# EAGLE design main-pic-bord (EAGLE 8.0.1)
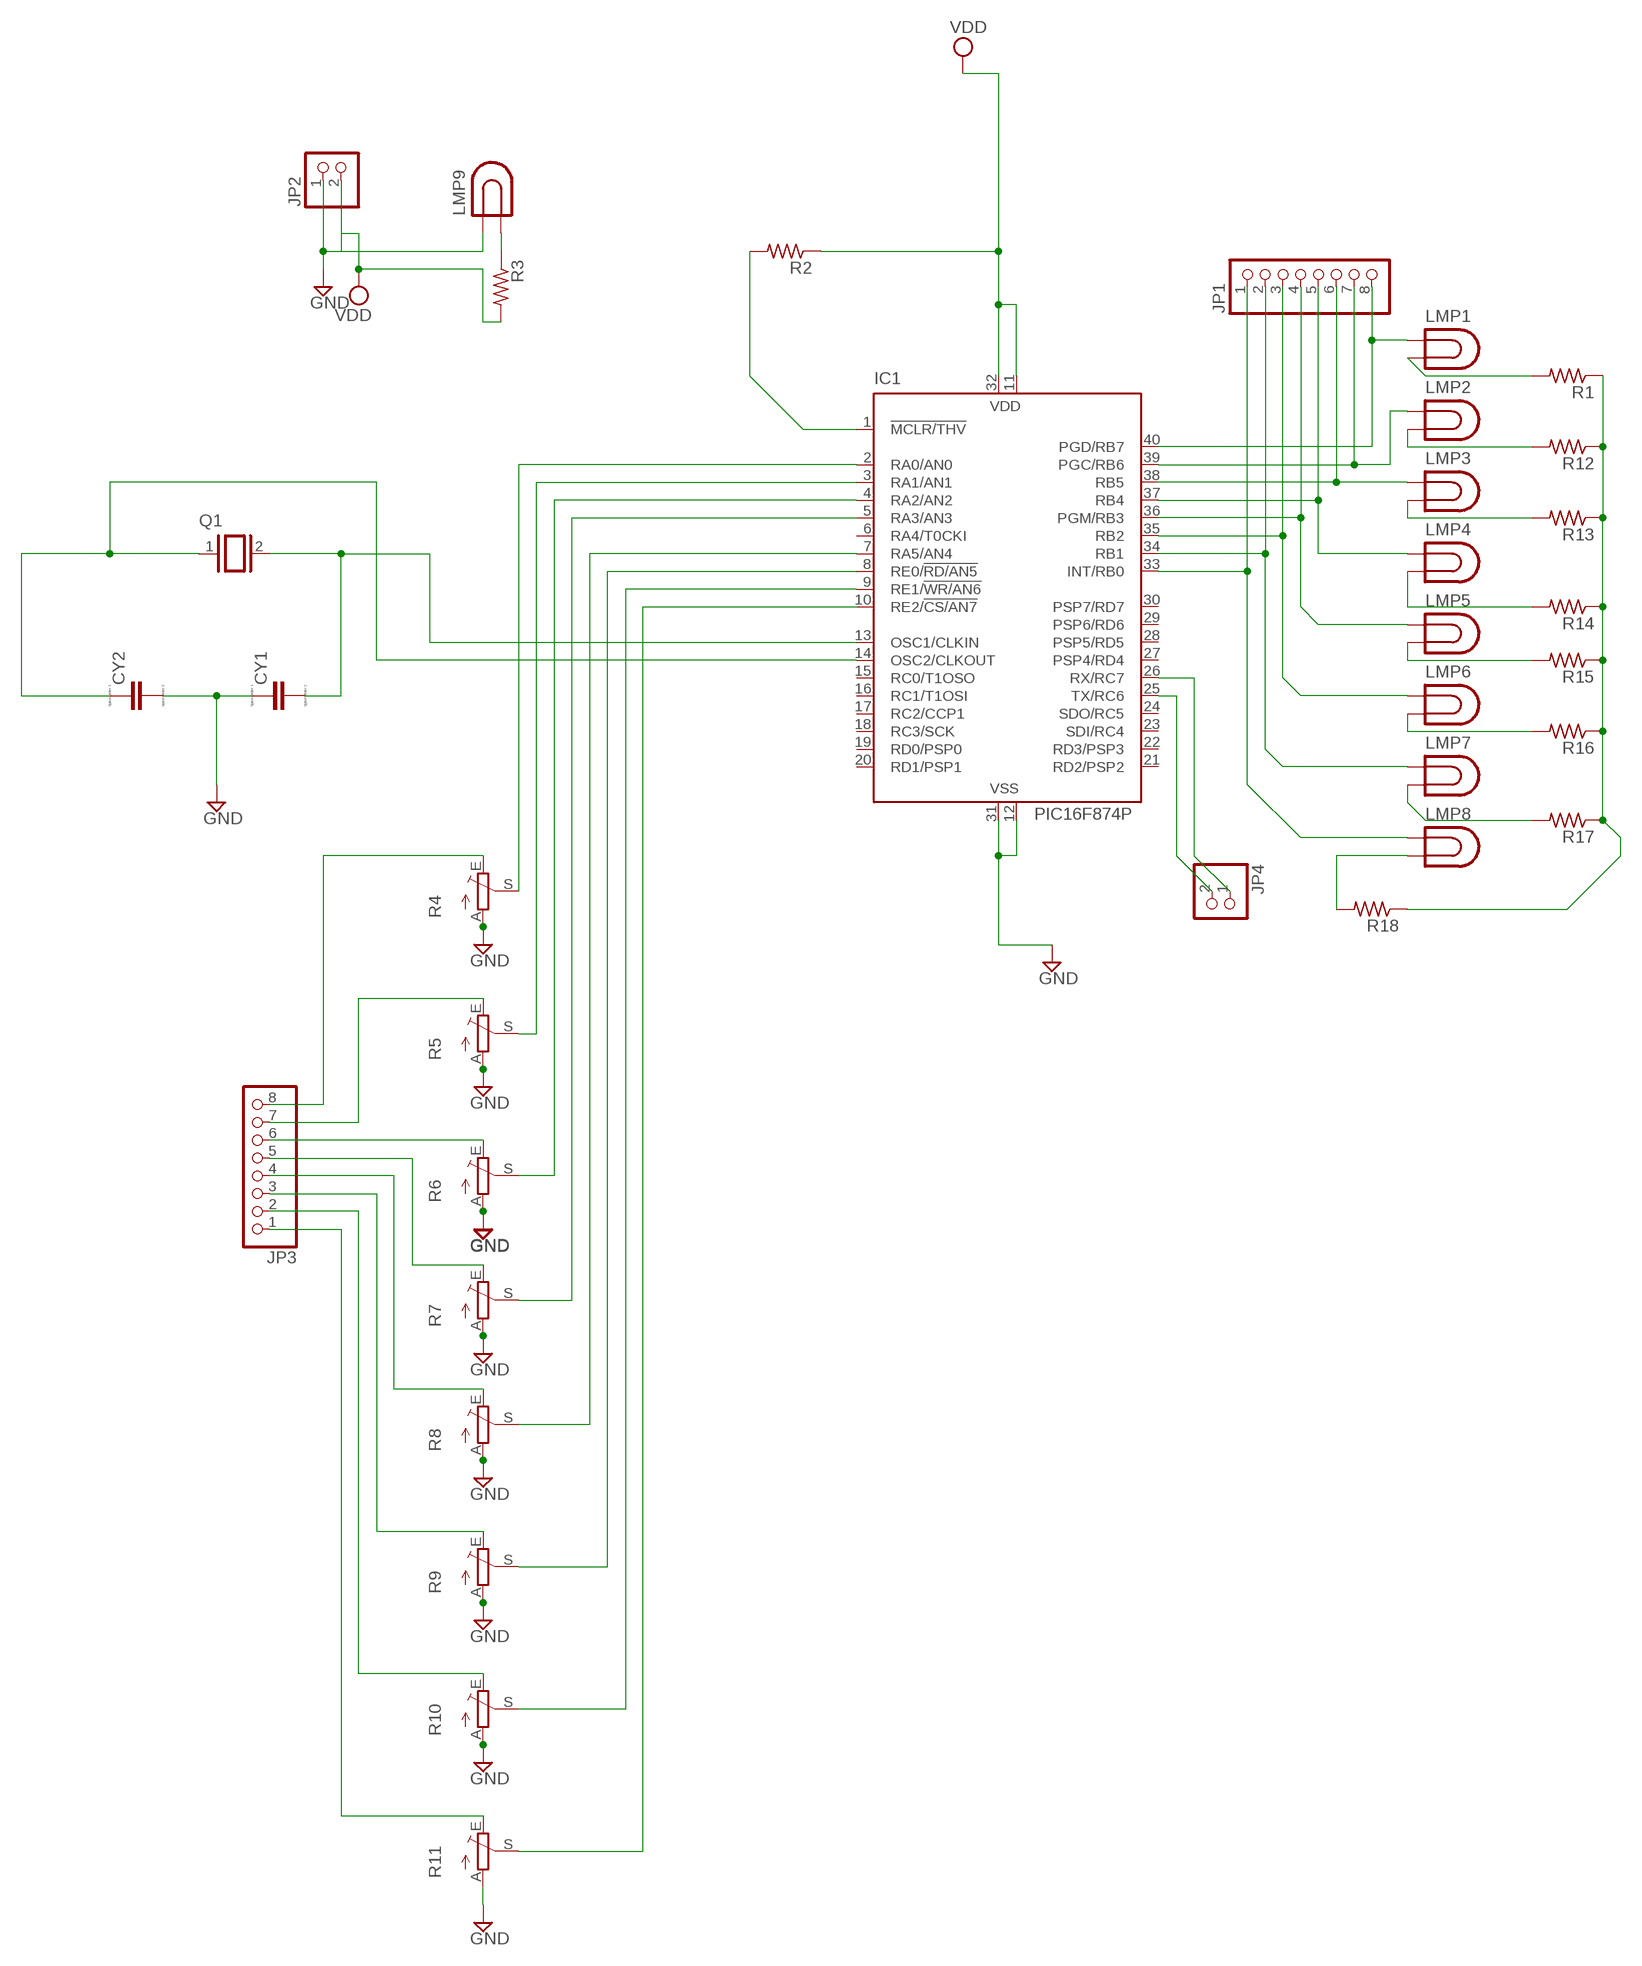
[diagram p0: schematic, sheet 1]

## Parts
CY1  CYYC7B5  [YC7B5]
CY2  CYYC7B5  [YC7B5]
IC1  PIC16F874P  [DIL40]
JP1  PINHD-1X8  [1X08]
JP2  PINHD-1X2  [1X02]
JP3  PINHD-1X8  [1X08]
JP4  PINHD-1X2  [1X02]
LMP1  LAMP  [LDH-5R]
LMP2  LAMP  [LDH-5R]
LMP3  LAMP  [LDH-5R]
LMP4  LAMP  [LDH-5R]
LMP5  LAMP  [LDH-5R]
LMP6  LAMP  [LDH-5R]
LMP7  LAMP  [LDH-5R]
LMP8  LAMP  [LDH-5R]
LMP9  LAMP  [LDH-5R]
Q1  XTAL/S  [QS]
R1  R-US_VMTB60  [VMTB60]
R2  R-US_VMTB60  [VMTB60]
R3  R-US_VMTB60  [VMTB60]
R4  TRIM_EU-CA6V  [CA6V]
R5  TRIM_EU-CA6V  [CA6V]
R6  TRIM_EU-CA6V  [CA6V]
R7  TRIM_EU-CA6V  [CA6V]
R8  TRIM_EU-CA6V  [CA6V]
R9  TRIM_EU-CA6V  [CA6V]
R10  TRIM_EU-CA6V  [CA6V]
R11  TRIM_EU-CA6V  [CA6V]
R12  R-US_VMTB60  [VMTB60]
R13  R-US_VMTB60  [VMTB60]
R14  R-US_VMTB60  [VMTB60]
R15  R-US_VMTB60  [VMTB60]
R16  R-US_VMTB60  [VMTB60]
R17  R-US_VMTB60  [VMTB60]
R18  R-US_VMTB60  [VMTB60]

## Nets
GND: CY1.1 CY2.2 IC1.12(VSS) IC1.31(VSS) JP2.1 LMP9.1 R4.A R5.A R6.A R7.A R8.A R9.A R10.A R11.A
N$1: IC1.2(RA0/AN0) R4.S
N$2: IC1.3(RA1/AN1) R5.S
N$3: IC1.4(RA2/AN2) R6.S
N$4: IC1.5(RA3/AN3) R7.S
N$5: IC1.7(RA5/AN4) R8.S
N$6: IC1.8(RE0/!RD/AN5) R9.S
N$7: IC1.9(RE1/!WR/AN6) R10.S
N$8: IC1.10(RE2/!CS/AN7) R11.S
N$9: JP3.8 R4.E
N$10: JP3.7 R5.E
N$11: JP3.6 R6.E
N$12: JP3.5 R7.E
N$13: JP3.4 R8.E
N$14: JP3.3 R9.E
N$15: JP3.2 R10.E
N$16: JP3.1 R11.E
N$17: IC1.33(INT/RB0) JP1.1 LMP8.1
N$18: CY1.2 IC1.13(OSC1/CLKIN) Q1.2
N$19: CY2.1 IC1.14(OSC2/CLKOUT) Q1.1
N$20: IC1.34(RB1) JP1.2 LMP7.1
N$21: IC1.35(RB2) JP1.3 LMP6.1
N$22: IC1.36(PGM/RB3) JP1.4 LMP5.1
N$23: IC1.37(RB4) JP1.5 LMP4.1
N$24: IC1.38(RB5) JP1.6 LMP3.1
N$25: IC1.39(PGC/RB6) JP1.7 LMP2.1
N$26: IC1.40(PGD/RB7) JP1.8 LMP1.1
N$27: LMP9.2 R3.1
N$28: LMP8.2 R18.2
N$29: IC1.25(TX/RC6) JP4.2
N$30: IC1.26(RX/RC7) JP4.1
N$31: LMP7.2 R17.2
N$32: LMP6.2 R16.2
N$33: LMP2.2 R12.2
N$34: IC1.1(!MCLR/THV) R2.2
N$35: LMP5.2 R15.2
N$36: LMP4.2 R14.2
N$37: LMP3.2 R13.2
N$38: LMP1.2 R1.2
N$40: R1.1 R12.1 R13.1 R14.1 R15.1 R16.1 R17.1 R18.1
VDD: IC1.11(VDD) IC1.32(VDD) JP2.2 R2.1 R3.2
Unconnected: IC1.6(RA4/T0CKI) IC1.15(RC0/T1OSO) IC1.16(RC1/T1OSI) IC1.17(RC2/CCP1) IC1.18(RC3/SCK) IC1.19(RD0/PSP0) IC1.20(RD1/PSP1) IC1.21(RD2/PSP2) IC1.22(RD3/PSP3) IC1.23(SDI/RC4) IC1.24(SDO/RC5) IC1.27(PSP4/RD4) IC1.28(PSP5/RD5) IC1.29(PSP6/RD6) IC1.30(PSP7/RD7)

## Library data of the parts
CY1 CY2 = resistor:CY: Y CAPACITOR for power line
IC1 = microchip:PIC16F87*: MICROCONTROLLER; MPN: PIC16F874-04I/P; OC_FARNELL: 1196797; OC_NEWARK: 24M5903
JP1 JP3 = pinhead:PINHD-1X8: PIN HEADER
JP2 JP4 = pinhead:PINHD-1X2: PIN HEADER
LMP1-LMP9 = special:LAMP: LED HOLDER
Q1 = special:XTAL/S: CRYSTAL
R1-R3 R12-R18 = resistor:R-US_: RESISTOR, American symbol
R4-R11 = pot:TRIM_EU-: POTENTIOMETER

## Board
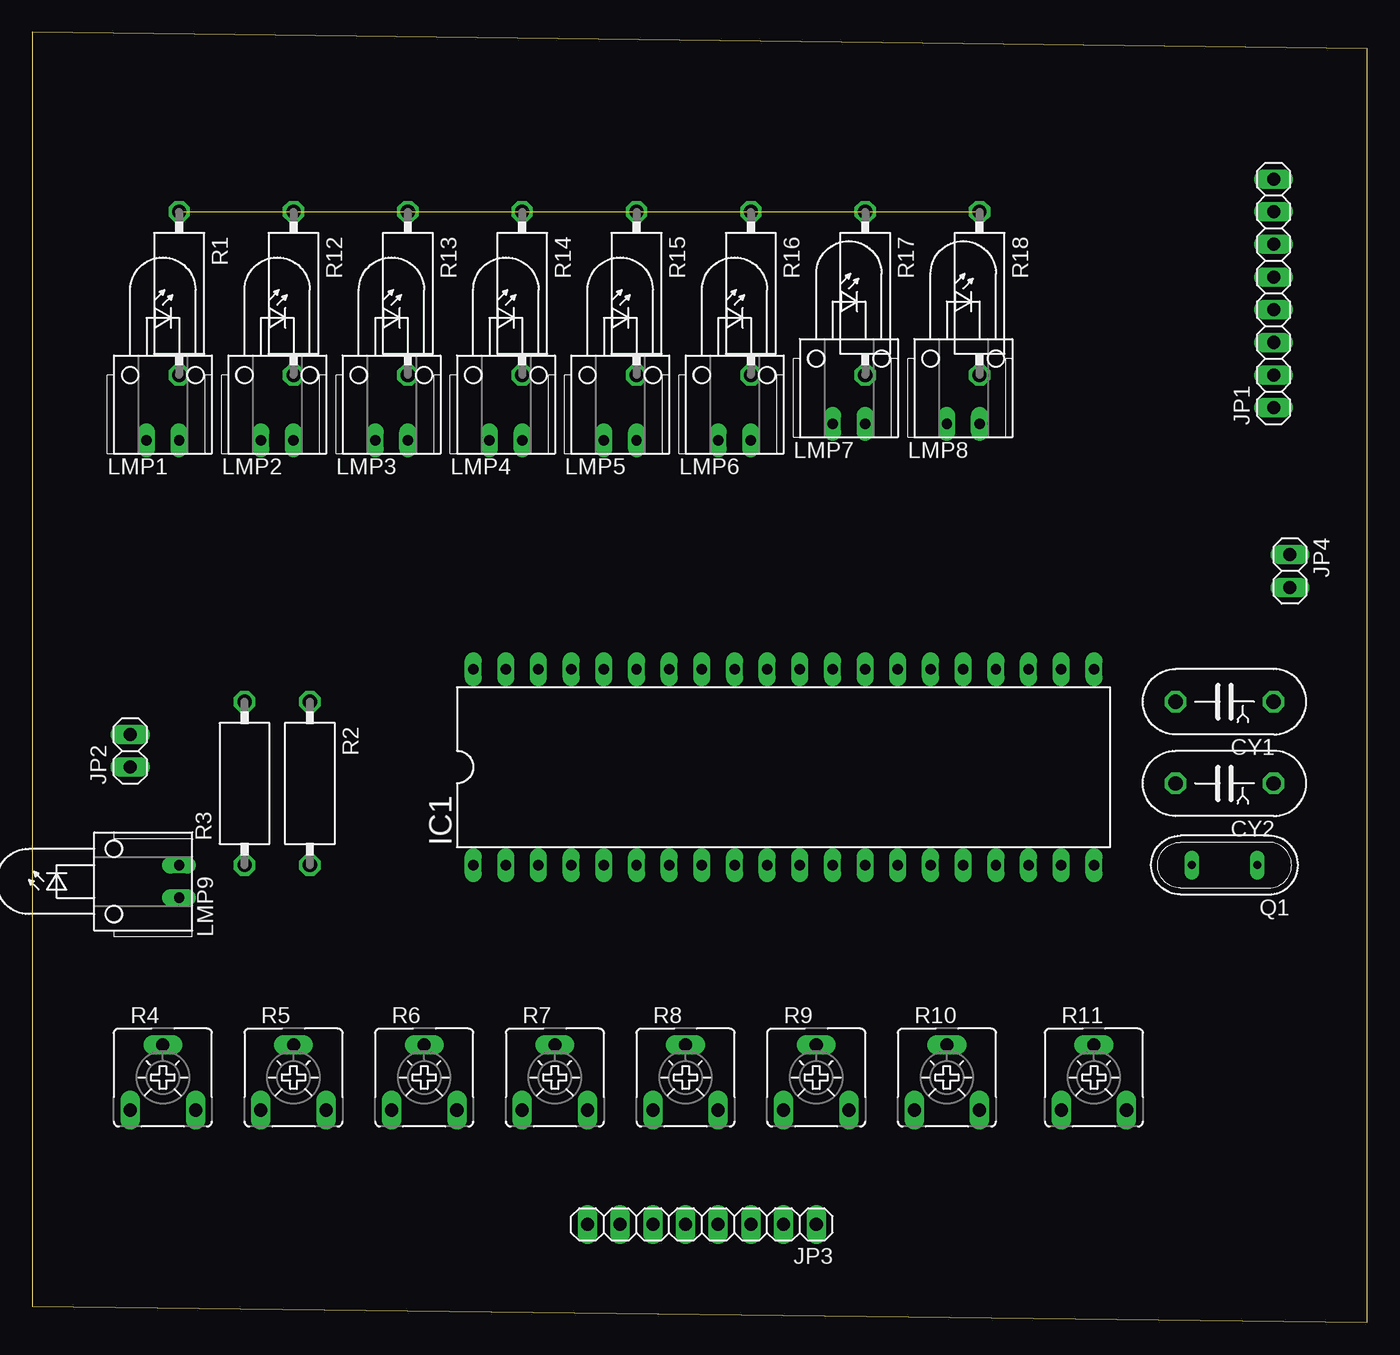
[diagram p1: board, top side]
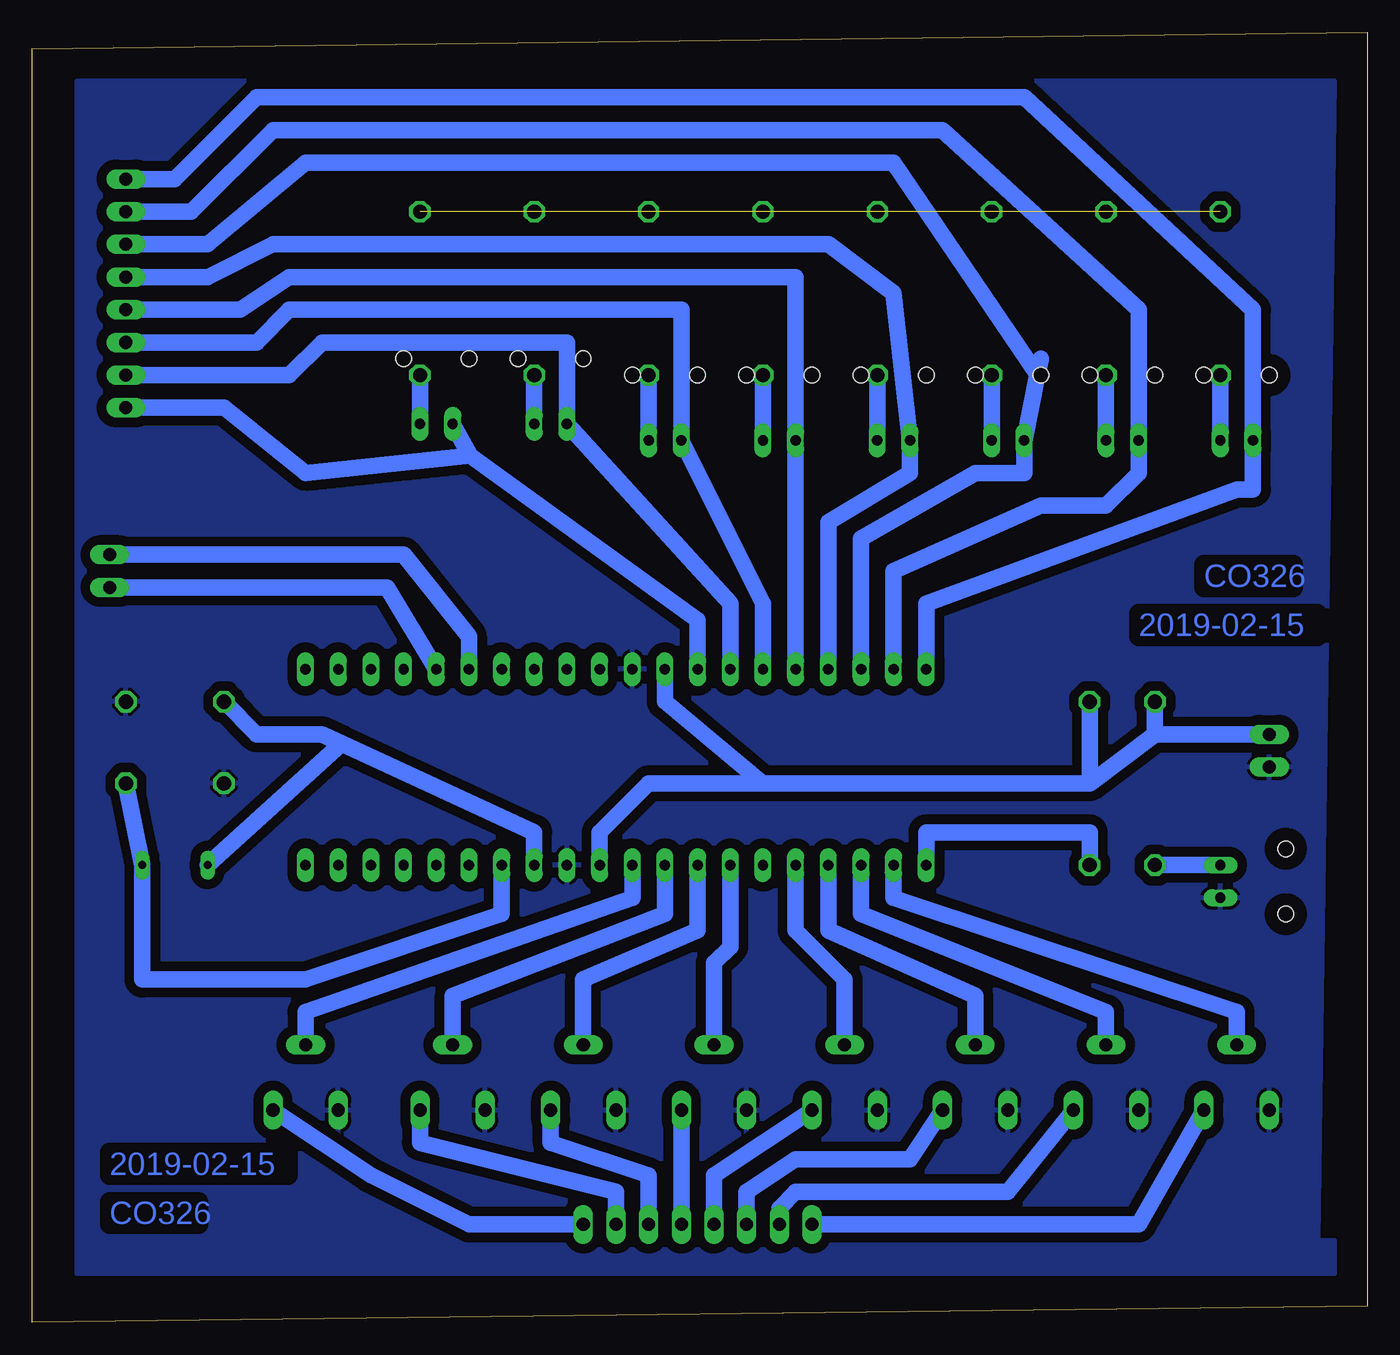
[diagram p2: board, bottom side, seen from below]

Size 103.81 x 100.32 mm. Coordinates in mm from the lower left corner, seen from the top.
Outline: 0,1.27 103.81,0 103.81,99.05 0,100.32 0,1.27
Copper layers (1*16): Top 0.035mm / dielectric 1.5mm / Bottom 0.035mm
Design rules "default *": minimum track width 10mil, minimum drill 24mil, track to track 30mil, track to pad 30mil, pad to pad 30mil, via to via 30mil, smd to smd 30mil, copper to edge 40mil, drill to drill 8mil, minimum pad ring 10mil, minimum via ring 8mil, stop-mask expansion 4mil, vias tented up to drill 0mil, thermal gap 10mil

### Footprints (pad centres in the part's own frame; a part is rotated, then mirrored left to right if it is on the bottom)
YC7B5 = drill 1.118 octagon: 1 -3.81,0; 2 3.81,0
DIL40 = drill 0.813 long: 1 -24.13,-7.62; 2 -21.59,-7.62; 3 -19.05,-7.62; 4 -16.51,-7.62; 5 -13.97,-7.62; 6 -11.43,-7.62; 7 -8.89,-7.62; 8 -6.35,-7.62; 9 -3.81,-7.62; 10 -1.27,-7.62; 11 1.27,-7.62; 12 3.81,-7.62; 13 6.35,-7.62; 14 8.89,-7.62; 15 11.43,-7.62; 16 13.97,-7.62; 17 16.51,-7.62; 18 19.05,-7.62; 19 21.59,-7.62; 20 24.13,-7.62; 21 24.13,7.62; 22 21.59,7.62; 23 19.05,7.62; 24 16.51,7.62; 25 13.97,7.62; 26 11.43,7.62; 27 8.89,7.62; 28 6.35,7.62; 29 3.81,7.62; 30 1.27,7.62; 31 -1.27,7.62; 32 -3.81,7.62; 33 -6.35,7.62; 34 -8.89,7.62; 35 -11.43,7.62; 36 -13.97,7.62; 37 -16.51,7.62; 38 -19.05,7.62; 39 -21.59,7.62; 40 -24.13,7.62
1X08 = drill 1.016 long: 1 -8.89,0; 2 -6.35,0; 3 -3.81,0; 4 -1.27,0; 5 1.27,0; 6 3.81,0; 7 6.35,0; 8 8.89,0
1X02 = drill 1.016 long: 1 -1.27,0; 2 1.27,0
LDH-5R = drill 0.813 long: 1 -1.27,-5.08; 2 1.27,-5.08 | hole 1.219: 2.54,0; -2.54,0
QS = drill 0.61 long: 1 -2.54,0; 2 2.54,0
VMTB60 = drill 1.1 octagon: 1 -6.35,0; 2 6.35,0
CA6V = drill 1.016 long: A -2.54,-2.54; E 2.54,-2.54; S 0,2.54

### Placement (x,y rotation side)
CY1  92.71,48.26 180 top
CY2  92.71,41.91 180 top
IC1  58.42,43.18 0 top
JP1  96.52,80.01 90 top
JP2  7.62,44.45 90 top
JP3  52.07,7.62 180 top
JP4  97.79,58.42 270 top
LMP1  10.16,73.66 0 top
LMP2  19.05,73.66 0 top
LMP3  27.94,73.66 0 top
LMP4  36.83,73.66 0 top
LMP5  45.72,73.66 0 top
LMP6  54.61,73.66 0 top
LMP7  63.5,74.93 0 top
LMP8  72.39,74.93 0 top
LMP9  6.35,34.29 90 top
Q1  92.71,35.56 180 top
R1  11.43,80.01 270 top
R2  21.59,41.91 270 top
R3  16.51,41.91 90 top
R4  10.16,19.05 0 top
R5  20.32,19.05 0 top
R6  30.48,19.05 0 top
R7  40.64,19.05 0 top
R8  50.8,19.05 0 top
R9  60.96,19.05 0 top
R10  71.12,19.05 0 top
R11  82.55,19.05 0 top
R12  20.32,80.01 270 top
R13  29.21,80.01 270 top
R14  38.1,80.01 270 top
R15  46.99,80.01 270 top
R16  55.88,80.01 270 top
R17  64.77,80.01 270 top
R18  73.66,80.01 270 top

### Tracks (layer width: path | path; a pad name or v marks a point on that pad's centre or on a via)
GND
  pour Bottom: 2.54,96.52 100.33,96.52 100.33,3.81 2.54,3.81 2.54,6.35 3.81,6.35
N$1
  Bottom 1.27: R4.S 10.16,24.13 36.83,33.02 IC1.2
N$2
  Bottom 1.27: IC1.3 39.37,31.75 20.32,24.13 R5.S
N$3
  Bottom 1.27: R6.S 30.48,25.4 41.91,30.48 IC1.4
N$4
  Bottom 1.27: R7.S 40.64,26.67 44.45,30.48 IC1.5
N$5
  Bottom 1.27: R8.S 50.8,27.94 49.53,29.21 IC1.7
N$6
  Bottom 1.27: R9.S 60.96,26.67 52.07,30.48 IC1.8
N$7
  Bottom 1.27: R10.S 71.12,25.4 54.61,31.75 IC1.9
N$8
  Bottom 1.27: IC1.10 57.15,33.02 82.55,24.13 R11.S
N$9
  Bottom 1.27: JP3.8 17.78,7.62 R4.E
N$10
  Bottom 1.27: JP3.7 45.72,8.89 44.45,10.16 27.94,10.16 R5.E
N$11
  Bottom 1.27: R6.E 35.56,12.7 44.45,12.7 48.26,10.16 JP3.6
N$12
  Bottom 1.27: JP3.5 50.8,11.43 R7.E
N$13
  Bottom 1.27: JP3.4 R8.E
N$14
  Bottom 1.27: JP3.3 55.88,11.43 63.5,13.97 R9.E
N$15
  Bottom 1.27: 58.42,8.89 JP3.2 58.42,10.16 73.66,13.97 R10.E
N$16
  Bottom 1.27: R11.E 77.47,11.43 69.85,7.62 JP3.1
N$17
  Bottom 1.27: 69.76,67.41 52.07,54.61 IC1.33 | 69.76,67.41 LMP8.1 | JP1.1 88.9,71.12 82.55,66.04 69.76,67.41
N$18
  Bottom 1.27: IC1.13 64.77,38.1 79.75,45.01 | 79.75,45.01 81.28,45.72 86.36,45.72 CY1.2 | Q1.2 79.75,45.01
N$19
  Bottom 1.27: IC1.14 67.31,31.75 82.55,26.67 95.25,26.67 Q1.1 CY2.1
N$20
  Bottom 1.27: IC1.34 49.53,55.88 LMP7.1 62.23,76.2 81.28,76.2 83.82,73.66 JP1.2
N$21
  Bottom 1.27: IC1.35 46.99,55.88 LMP6.1 53.34,78.74 83.82,78.74 86.36,76.2 JP1.3
N$22
  Bottom 1.27: IC1.36 LMP5.1 44.45,81.28 83.82,81.28 87.63,78.74 JP1.4
N$23
  Bottom 1.27: IC1.37 41.91,62.23 35.56,66.04 LMP4.1 36.83,80.01 41.91,83.82 85.09,83.82 90.17,81.28 JP1.5
N$24
  Bottom 1.27: IC1.38 39.37,60.96 30.48,66.04 26.67,66.04 LMP3.1 25.64,73.71 | 25.4,74.93 25.64,73.71 | 25.64,73.71 36.83,90.17 82.55,90.17 90.17,83.82 JP1.6
N$25
  Bottom 1.27: IC1.39 36.83,58.42 25.4,63.5 20.32,63.5 17.78,66.04 LMP2.1 17.78,78.74 33.02,92.71 85.09,92.71 91.44,86.36 JP1.7
N$26
  Bottom 1.27: IC1.40 34.29,55.88 10.16,64.77 8.89,64.77 LMP1.1 8.89,78.74 26.67,95.25 86.36,95.25 92.71,88.9 JP1.8
N$27
  Bottom 1.27: LMP9.2 R3.1
N$28
  Bottom 1.27: LMP8.2 R18.2
N$29
  Bottom 1.27: IC1.25 76.2,57.15 JP4.2
N$30
  Bottom 1.27: JP4.1 74.93,59.69 69.85,53.34 IC1.26
N$31
  Bottom 1.27: LMP7.2 R17.2
N$32
  Bottom 1.27: LMP6.2 R16.2
N$33
  Bottom 1.27: LMP2.2 R12.2
N$34
  Bottom 1.27: R2.2 21.59,38.1 34.29,38.1 IC1.1
N$35
  Bottom 1.27: LMP5.2 R15.2
N$36
  Bottom 1.27: LMP4.2 R14.2
N$37
  Bottom 1.27: LMP3.2 R13.2
N$38
  Bottom 1.27: LMP1.2 R1.2
N$40  (7 unrouted)
VDD
  Bottom 1.27: 16.51,45.72 JP2.2 | 16.51,45.72 R3.2 | R2.1 21.59,41.91 | 21.59,41.91 16.51,45.72 | 21.59,41.91 46.99,41.91 | 46.99,41.91 54.61,48.26 IC1.32 | 46.99,41.91 55.88,41.91 59.69,38.1 IC1.11

### Text on the board
Bottom: CO326 | 2019-02-15 | 2019-02-15 | CO326